# EAGLE design ntp_clock (EAGLE 7.2.0)
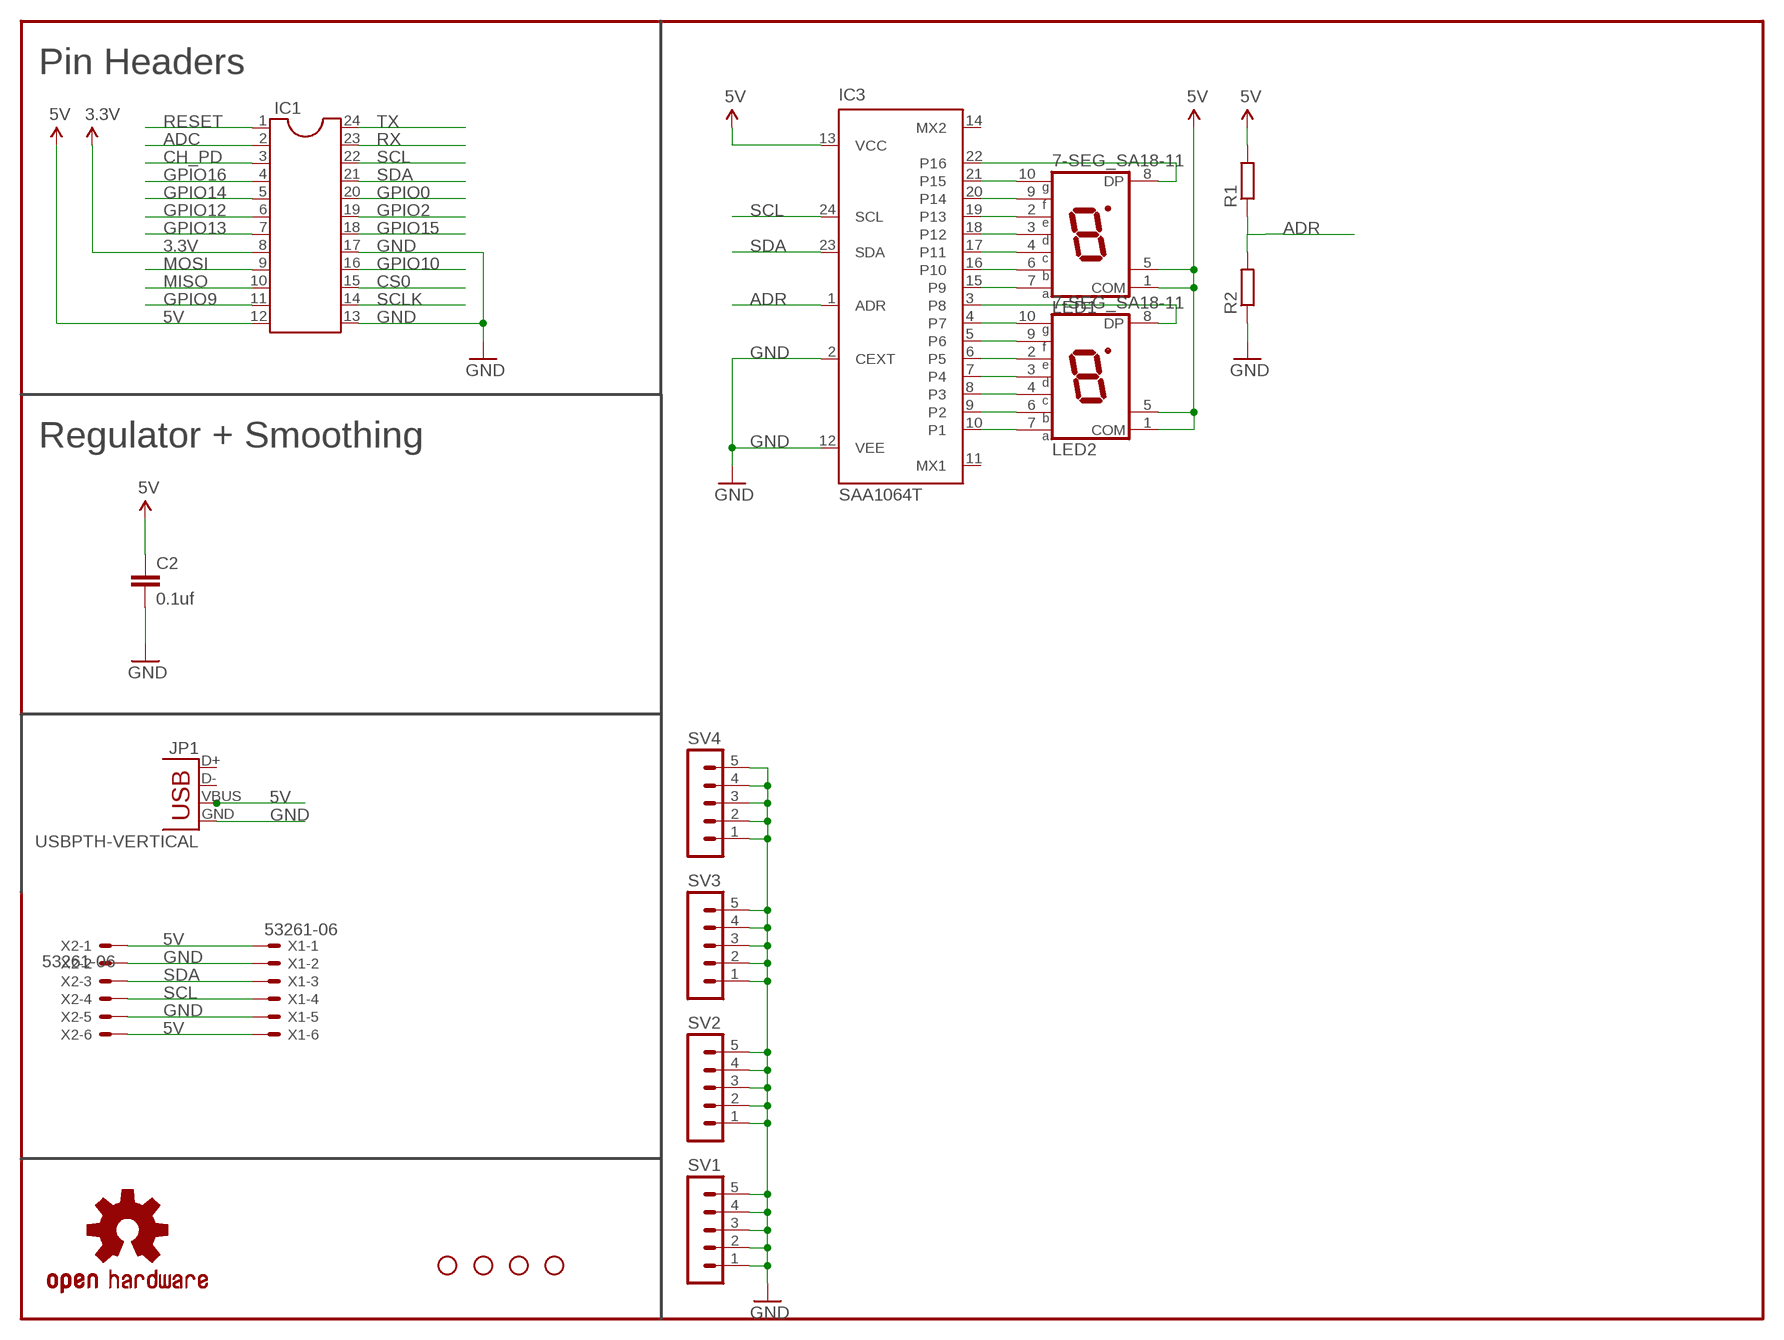
[diagram p0: schematic, sheet 1]

## Parts
C2  0.1uf  CAP1206  [1206]
FRAME1  FRAME-LETTERNO_PACKAGE  [DUMMY]
IC1  DIL24-9  [DIL24-9]
IC3  SAA1064T  [SO24]
JP1  USBPTH-VERTICAL  [USB-B-PTH-VERTICAL]
LED1  7-SEG_SA18-11  [SA18-11]
LED2  7-SEG_SA18-11  [SA18-11]
LOGO1  OSHW-LOGOS  [OSHW-LOGO-S]
R1  R-EU_0207/12  [0207/12]
R2  R-EU_0207/12  [0207/12]
STANDOFF1  STAND-OFF  [STAND-OFF]
STANDOFF2  STAND-OFF  [STAND-OFF]
STANDOFF3  STAND-OFF  [STAND-OFF]
STANDOFF4  STAND-OFF  [STAND-OFF]
SV1  MA05-1  [MA05-1]
SV2  MA05-1  [MA05-1]
SV3  MA05-1  [MA05-1]
SV4  MA05-1  [MA05-1]
X1  53261-06  [53261-06]
X2  53261-06  [53261-06]

## Nets
3.3V: IC1.8
5V: C2.1 IC1.12 IC3.13(VCC) JP1.VBUS LED1.1(COM) LED1.5(COM) LED2.1(COM) LED2.5(COM) R1.2 X1.1 X1.6 X2.1 X2.6
ADC: IC1.2
ADR: IC3.1(ADR) R1.1 R2.2
CH_PD: IC1.3
CS0: IC1.15
GND: C2.2 IC1.13 IC1.17 IC3.2(CEXT) IC3.12(VEE) JP1.GND R2.1 SV1.1 SV1.2 SV1.3 SV1.4 SV1.5 SV2.1 SV2.2 SV2.3 SV2.4 SV2.5 SV3.1 SV3.2 SV3.3 SV3.4 SV3.5 SV4.1 SV4.2 SV4.3 SV4.4 SV4.5 X1.2 X1.5 X2.2 X2.5
GPIO0: IC1.20
GPIO2: IC1.19
GPIO9: IC1.11
GPIO10: IC1.16
GPIO12: IC1.6
GPIO13: IC1.7
GPIO14: IC1.5
GPIO15: IC1.18
GPIO16: IC1.4
MISO: IC1.10
MOSI: IC1.9
N$1: IC3.5(P6) LED2.9(F)
N$2: IC3.7(P4) LED2.3(D)
N$3: IC3.9(P2) LED2.6(B)
N$4: IC3.10(P1) LED2.7(A)
N$5: IC3.8(P3) LED2.4(C)
N$6: IC3.6(P5) LED2.2(E)
N$7: IC3.4(P7) LED2.10(G)
N$8: IC3.3(P8) LED2.8(DP)
N$9: IC3.20(P14) LED1.9(F)
N$10: IC3.18(P12) LED1.3(D)
N$11: IC3.16(P10) LED1.6(B)
N$12: IC3.15(P9) LED1.7(A)
N$13: IC3.17(P11) LED1.4(C)
N$14: IC3.19(P13) LED1.2(E)
N$15: IC3.21(P15) LED1.10(G)
N$16: IC3.22(P16) LED1.8(DP)
RESET: IC1.1
RX: IC1.23
SCL: IC1.22 IC3.24(SCL) X1.4 X2.4
SCLK: IC1.14
SDA: IC1.21 IC3.23(SDA) X1.3 X2.3
TX: IC1.24
Unconnected: IC3.11(MX1) IC3.14(MX2) JP1.D+ JP1.D-

## Notes on the sheet
- Pin Headers
- Regulator + Smoothing

## Library data of the parts
C2 = SparkFun-Capacitors:CAP: Capacitor Standard 0603 ceramic capacitor, and 0.1" leaded capacitor.
FRAME1 = SparkFun-Aesthetics:FRAME-LETTER: Schematic Frame Standard 8.5x11 US Letter frame; DESIGNER: Nobody; VERSION: v01
IC1 = ic-package:DIL24: Dual In Line
IC3 = micro-philips:SAA1064: I2C-Bus 4-digit LED-DRIVER; MPN: SAA1064T/N2,118; OC_FARNELL: unknown; OC_NEWARK: 70R8648
JP1 = SparkFun-Connectors:USB: USB Connectors USB-B-PTH is fully proven SKU : PRT-00139/CONN-08278 USB-miniB is fully proven SKU : PRT-00587 USB-A-PCB is untested. USB-A-H is throughly reviewed, but untested. Spark Fun Electronics SKU : PRT-00437 USB-B-SMT is throughly reviewed, but untested. Needs silkscreen touching up. USB-A-S has not been used/tested USB-MB-H has not been used/tested USB-MICROB has been used. CONN-09505
LED1 LED2 = display-kingbright:7-SEG_: Kingbright 14.2mm (0.56 INCH) SINGLE DIGIT NUMERIC DUISPLAY Source: SA56-11EWA(Ver1189471036.pdf; OC_FARNELL: unknown; OC_NEWARK: unknown
LOGO1 = SparkFun-Aesthetics:OSHW-LOGO: Open Source Hardware Logo This logo indicates the piece of hardware it is found on incorporates a OSHW license and/or adheres to the definition of open source hardware found here: http://freedomdefined.org/OSHW
R1 R2 = rcl:R-EU_: RESISTOR, European symbol
STANDOFF1-STANDOFF4 = SparkFun-Electromechanical:STAND-OFF: #4 Stand Off This is the mechanical footprint for a #4 phillips button head screw. Use the keepout ring to avoid running the screw head into surrounding components. SKU : PRT-00447
SV1-SV4 = con-lstb:MA05-1: PIN HEADER; OC_FARNELL: unknown; OC_NEWARK: unknown
X1 X2 = con-molex:53?-06: CONNECTOR wire to board 1.25 mm (.049 inch) pitch header; OC_FARNELL: 1125375; OC_NEWARK: unknown

## Net classes
1 power: width 0.254 mm

## Board
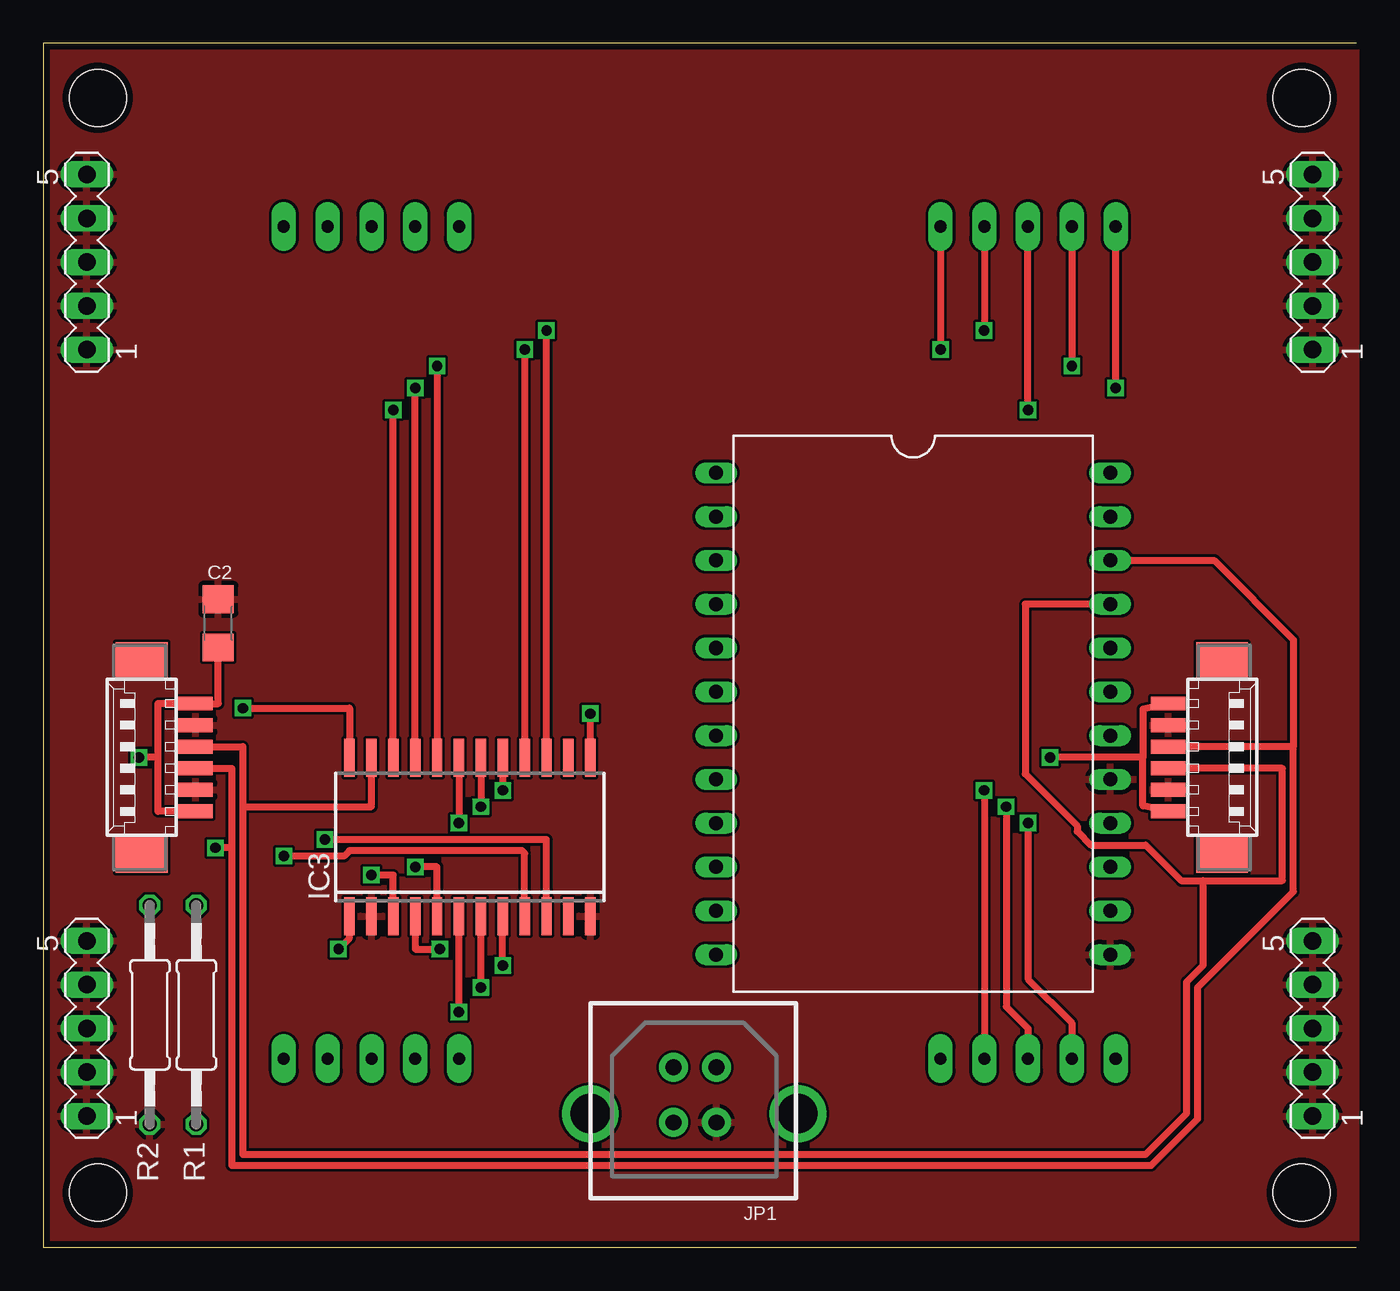
[diagram p1: board, top side]
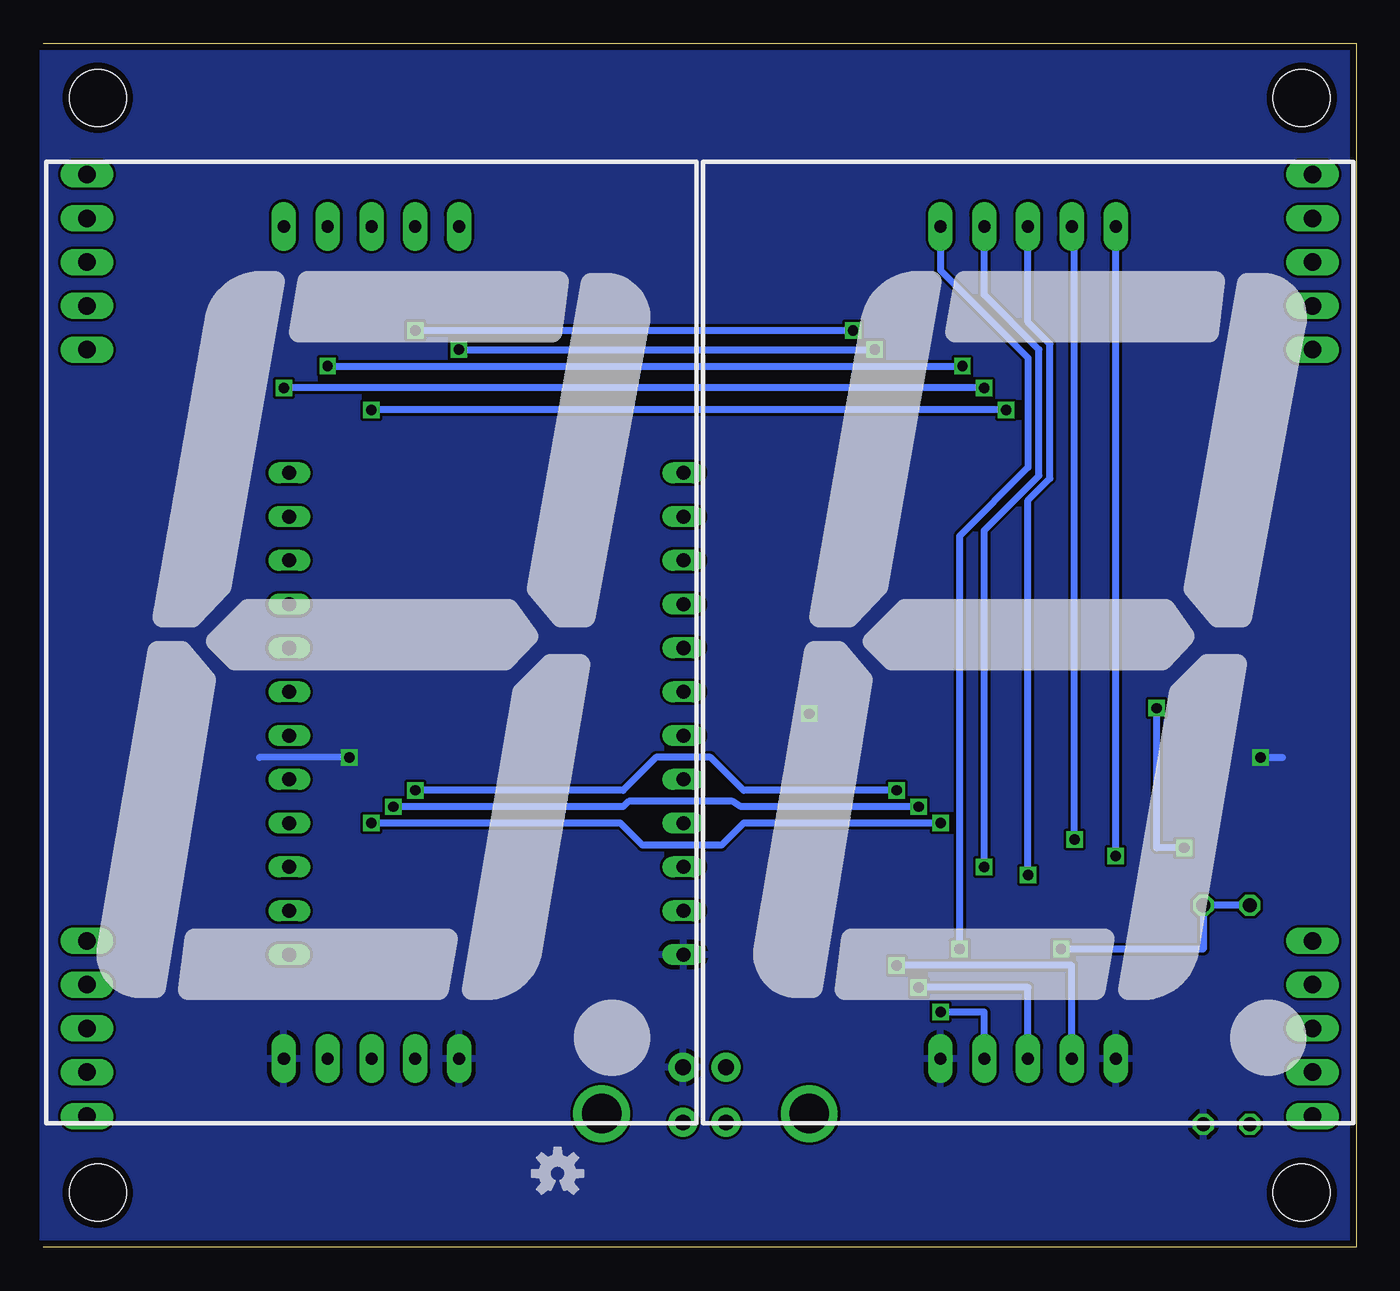
[diagram p2: board, bottom side, seen from below]

Size 76.2 x 69.85 mm. Coordinates in mm from the lower left corner, seen from the top.
Outline: 76.2,0 0,0 0,69.85 76.2,69.85
Copper layers (1*16): Top 0.0356mm / dielectric 1.5011mm / Bottom 0.0356mm
Design rules "LaenPCBOrder": minimum track width 6mil, minimum drill 13mil, track to track 6mil, track to pad 6mil, pad to pad 6mil, via to via 6mil, smd to smd 6mil, copper to edge 15mil, drill to drill 6mil, minimum pad ring 7mil, minimum via ring 7mil, stop-mask expansion 3mil, vias tented up to drill 0mil, thermal gap 10mil

### Footprints (pad centres in the part's own frame; a part is rotated, then mirrored left to right if it is on the bottom)
1206 = smd 1.6 x 1.8: 1 -1.4,0; 2 1.4,0
DIL24-9 = drill 0.813 long: 1 -13.97,-11.43; 2 -11.43,-11.43; 3 -8.89,-11.43; 4 -6.35,-11.43; 5 -3.81,-11.43; 6 -1.27,-11.43; 7 1.27,-11.43; 8 3.81,-11.43; 9 6.35,-11.43; 10 8.89,-11.43; 11 11.43,-11.43; 12 13.97,-11.43; 13 13.97,11.43; 14 11.43,11.43; 15 8.89,11.43; 16 6.35,11.43; 17 3.81,11.43; 18 1.27,11.43; 19 -1.27,11.43; 20 -3.81,11.43; 21 -6.35,11.43; 22 -8.89,11.43; 23 -11.43,11.43; 24 -13.97,11.43
SO24 = smd 0.6 x 2.2: 1 -6.985,-4.6; 2 -5.715,-4.6; 3 -4.445,-4.6; 4 -3.175,-4.6; 5 -1.905,-4.6; 6 -0.635,-4.6; 7 0.635,-4.6; 8 1.905,-4.6; 9 3.175,-4.6; 10 4.445,-4.6; 11 5.715,-4.6; 12 6.985,-4.6; 13 6.985,4.6; 14 5.715,4.6; 15 4.445,4.6; 16 3.175,4.6; 17 1.905,4.6; 18 0.635,4.6; 19 -0.635,4.6; 20 -1.905,4.6; 21 -3.175,4.6; 22 -4.445,4.6; 23 -5.715,4.6; 24 -6.985,4.6
USB-B-PTH-VERTICAL = drill 0.914 pad 1.676: D+ 4.826,4.394; D- 4.826,7.595; GND 7.315,4.394; VBUS 7.315,7.595 | drill 2.286: P$1 0,4.902; P$2 12.04,4.902
SA18-11 = drill 0.7 pad 1.422 long: 1 -5.08,-24.13; 2 -2.54,-24.13; 3 0,-24.13; 4 2.54,-24.13; 5 5.08,-24.13; 6 5.08,24.13; 7 2.54,24.13; 8 0,24.13; 9 -2.54,24.13; 10 -5.08,24.13
0207/12 = drill 0.813 octagon: 1 -6.35,0; 2 6.35,0
STAND-OFF = hole 3.302: 0,0
MA05-1 = drill 1.016 long: 1 -5.08,0; 2 -2.54,0; 3 0,0; 4 2.54,0; 5 5.08,0
53261-06 = smd 0.8 x 2: 1 3.125,-2.5; 2 1.875,-2.5; 3 0.625,-2.5; 4 -0.625,-2.5; 5 -1.875,-2.5; 6 -3.125,-2.5 | smd 2.1 x 3: S1 5.625,0.625; S2 -5.625,0.625

### Placement (x,y rotation side)
C2  10.16,36.2 90 top
FRAME1  0,-0.16 0 top
IC1  50.48,30.96 270 top
IC3  24.77,23.81 0 top
JP1  31.75,2.86 0 top
LED1  57.15,35.08 0 bottom
LED2  19.05,35.08 0 bottom
LOGO1  46.35,4.29 0 bottom
R1  8.89,13.49 270 top
R2  6.19,13.49 90 top
STANDOFF1  3.17,3.17 0 top
STANDOFF2  73.03,3.17 0 top
STANDOFF3  3.17,66.67 0 top
STANDOFF4  73.03,66.67 0 top
SV1  2.54,57.15 90 top
SV2  2.54,12.7 90 top
SV3  73.66,57.15 90 top
SV4  73.66,12.7 90 top
X1  6.35,28.42 90 top
X2  67.79,28.42 270 top

### Tracks (layer width: path | path; a pad name or v marks a point on that pad's centre or on a via)
5V  (via drill 0.6)
  Top 0.406: 6.67,28.42 6.67,31.54 X1.1 10.16,31.54 C2.1 | X1.6 6.67,25.29 6.67,28.42 | 6.67,28.42 v5.56,28.42 | IC3.13 v31.75,30.96 | X2.1 63.82,25.61 63.82,28.42 | 63.82,28.42 v58.42,28.42 | X2.6 63.82,31.22 63.82,28.42
  Bottom 0.406: v5.56,28.42 4.29,28.42 | v31.75,30.96 31.75,30.8 | v58.42,28.42 63.66,28.42
  pour Bottom: 0,0 76.2,0 76.2,69.85 0,69.85
ADR  (via drill 0.6)
  Top 0.406: v17.14,17.3 17.78,17.94 IC3.1 17.78,19.84
  Bottom 0.406: R2.2 R1.1 8.89,17.3 v17.14,17.3
GND
  pour Top: 0,0 76.2,0 76.2,69.85 0,69.85
N$1  (via drill 0.6)
  Top 0.406: IC3.5 22.86,22.07 v21.59,22.07
  Bottom 0.406: v21.59,22.07 21.59,41.59 18.41,44.77 18.41,52.07 21.59,55.24 LED2.9
N$2  (via drill 0.6)
  Top 0.406: v25.4,15.08 IC3.7
  Bottom 0.406: LED2.3 19.05,15.08 v25.4,15.08
N$3  (via drill 0.6)
  Top 0.406: IC3.9 27.94,22.86 27.78,23.02 17.78,23.02 17.46,22.7 v13.97,22.7
  Bottom 0.406: v13.97,22.7 LED2.6
N$4  (via drill 0.6)
  Top 0.406: IC3.10 29.21,23.65 v16.35,23.65
  Bottom 0.406: v16.35,23.65 16.35,59.21 LED2.7
N$5  (via drill 0.6)
  Top 0.406: v26.67,16.35 IC3.8
  Bottom 0.406: LED2.4 16.51,16.35 v26.67,16.35
N$6  (via drill 0.6)
  Top 0.406: v24.13,13.65 IC3.6
  Bottom 0.406: LED2.2 21.59,13.65 v24.13,13.65
N$7  (via drill 0.6)
  Top 0.406: IC3.4 21.59,17.3 v23.02,17.3
  Bottom 0.406: v23.02,17.3 23.02,41.27 19.05,45.24 19.05,51.59 24.13,56.67 LED2.10
N$8  (via drill 0.6)
  Top 0.406: IC3.3 20.32,21.59 v19.05,21.59
  Bottom 0.406: v19.05,21.59 19.05,43.34 17.78,44.61 17.78,52.39 19.05,53.66 LED2.8
N$9  (via drill 0.6)
  Top 0.406: LED1.9 v59.69,51.12 | v22.86,51.12 IC3.20
  Bottom 0.406: v59.69,51.12 v22.86,51.12
N$10  (via drill 0.6)
  Top 0.406: IC3.18 v25.4,25.56 | v55.88,25.56 55.88,13.97 57.15,12.7 LED1.3
  Bottom 0.406: v25.4,25.56 35.72,25.56 36.2,25.88 42.23,25.88 42.55,25.56 v55.88,25.56
N$11  (via drill 0.6)
  Top 0.406: LED1.6 v52.07,52.07 | v27.94,52.07 IC3.16
  Bottom 0.406: v52.07,52.07 v27.94,52.07
N$12  (via drill 0.6)
  Top 0.406: IC3.15 v29.21,53.18 | LED1.7 v54.61,53.18
  Bottom 0.406: v54.61,53.18 v29.21,53.18
N$13  (via drill 0.6)
  Top 0.406: IC3.17 v26.67,26.51 | v54.61,26.51 LED1.4
  Bottom 0.406: v26.67,26.51 35.56,26.51 37.47,28.42 40.64,28.42 42.55,26.51 v54.61,26.51
N$14  (via drill 0.6)
  Top 0.406: IC3.19 v24.13,24.61 | v57.15,24.61 57.15,15.56 59.69,13.02 LED1.2
  Bottom 0.406: v24.13,24.61 35.56,24.61 36.83,23.34 41.43,23.34 42.7,24.61 v57.15,24.61
N$15  (via drill 0.6)
  Top 0.406: IC3.21 v21.59,49.85 | v62.23,49.85 LED1.10
  Bottom 0.406: v21.59,49.85 v62.23,49.85
N$16  (via drill 0.6)
  Top 0.406: IC3.22 v20.32,48.58 | v57.15,48.58 LED1.8
  Bottom 0.406: v20.32,48.58 v57.15,48.58
SCL  (via drill 0.6)
  Top 0.406: X1.4 10.95,27.79 10.95,23.18 | 10.95,23.18 10.95,4.76 64.29,4.76 66.99,7.46 66.99,15.08 72.55,20.64 72.55,29.05 | 72.55,29.05 X2.4 | 10.95,23.18 v10,23.18 | v11.59,31.27 17.78,31.27 IC3.24 | IC1.22 67.94,39.85 72.55,35.24 72.55,29.05
  Bottom 0.406: v10,23.18 11.59,23.18 v11.59,31.27
SDA
  Top 0.406: X1.3 11.59,29.04 11.59,25.56 | 11.59,25.56 11.59,5.4 63.98,5.4 66.36,7.78 66.36,15.4 67.31,16.35 67.31,21.27 | 67.31,21.27 71.91,21.27 71.91,27.78 X2.3 | 11.59,25.56 19.05,25.56 IC3.23 | IC1.21 56.99,37.31 56.99,27.46 60.01,24.45 60.01,24.13 60.8,23.34 63.98,23.34 66.04,21.27 67.31,21.27